# EAGLE design Digi32MCU (EAGLE 5.11)
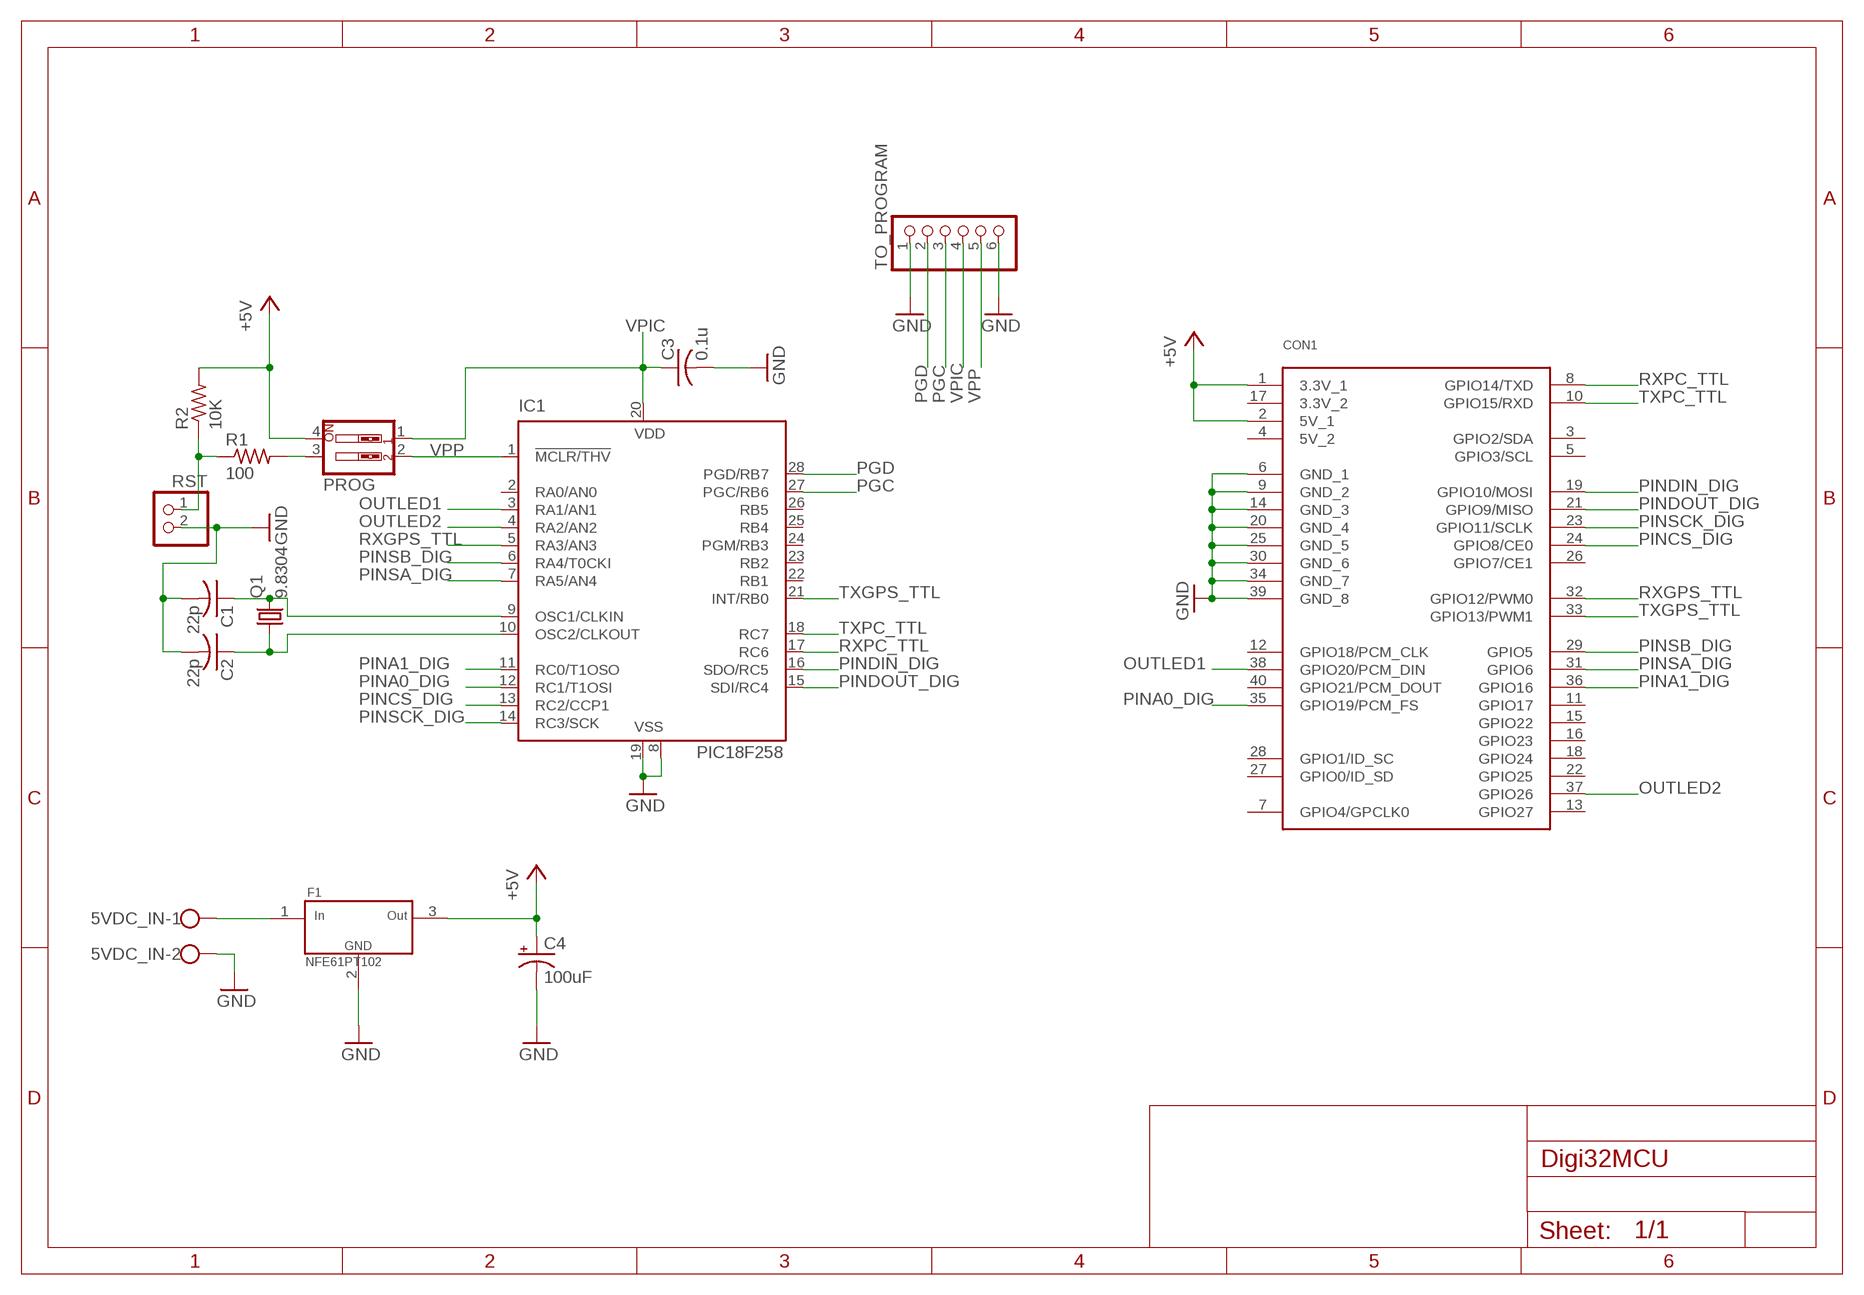
[diagram p0: schematic, sheet 1]

## Parts
5VDC_IN  W237-102  [W237-102]
C1  22p  C-USC0603  [C0603]
C2  22p  C-USC0603  [C0603]
C3  0.1u  C-USC0603  [C0603]
C4  100uF  CPOL-USE  [PANASONIC_E]
CON1  DIGI32_MCU  [MCU_32]
F1  NFE61PT102  EMIFIL  [NFE-2706]
IC1  PIC18F258  PIC16F876SO  [SO28W]
PROG  SW_DIP-2  [EDG-02]
Q1  9.8304  CRYSTALSM49  [SM49]
R1  100  R-US_R0603  [R0603]
R2  10K  R-US_R0603  [R0603]
RST  PINHD-1X2/90  [1X02/90]
TO_PROGRAM  PINHD-1X6/90  [1X06/90]

## Nets
+5V: C4.+ CON1.1(3.3V_1) CON1.2(5V_1) F1.3 PROG.4 R2.2
GND: 5VDC_IN.2 C1.2 C2.2 C3.2 C4.- CON1.6(GND_1) CON1.9(GND_2) CON1.14(GND_3) CON1.20(GND_4) CON1.25(GND_5) CON1.30(GND_6) CON1.34(GND_7) CON1.39(GND_8) F1.2 IC1.8(VSS) IC1.19(VSS) RST.2 TO_PROGRAM.1 TO_PROGRAM.6
N$1: C1.1 IC1.9(OSC1/CLKIN) Q1.2
N$2: C2.1 IC1.10(OSC2/CLKOUT) Q1.1
N$6: 5VDC_IN.1 F1.1
N$7: R1.1 R2.1 RST.1
N$8: PROG.3 R1.2
OUTLED1: CON1.38(GPIO20/PCM_DIN) IC1.3(RA1/AN1)
OUTLED2: CON1.37(GPIO26) IC1.4(RA2/AN2)
PGC: IC1.27(PGC/RB6) TO_PROGRAM.3
PGD: IC1.28(PGD/RB7) TO_PROGRAM.2
PINA0_DIG: CON1.35(GPIO19/PCM_FS) IC1.12(RC1/T1OSI)
PINA1_DIG: CON1.36(GPIO16) IC1.11(RC0/T1OSO)
PINCS_DIG: CON1.24(GPIO8/CE0) IC1.13(RC2/CCP1)
PINDIN_DIG: CON1.19(GPIO10/MOSI) IC1.16(SDO/RC5)
PINDOUT_DIG: CON1.21(GPIO9/MISO) IC1.15(SDI/RC4)
PINSA_DIG: CON1.31(GPIO6) IC1.7(RA5/AN4)
PINSB_DIG: CON1.29(GPIO5) IC1.6(RA4/T0CKI)
PINSCK_DIG: CON1.23(GPIO11/SCLK) IC1.14(RC3/SCK)
RXGPS_TTL: CON1.32(GPIO12/PWM0) IC1.5(RA3/AN3)
RXPC_TTL: CON1.8(GPIO14/TXD) IC1.17(RC6)
TXGPS_TTL: CON1.33(GPIO13/PWM1) IC1.21(INT/RB0)
TXPC_TTL: CON1.10(GPIO15/RXD) IC1.18(RC7)
VPIC: C3.1 IC1.20(VDD) PROG.1 TO_PROGRAM.4
VPP: IC1.1(!MCLR/THV) PROG.2 TO_PROGRAM.5
Unconnected: CON1.3(GPIO2/SDA) CON1.5(GPIO3/SCL) CON1.7(GPIO4/GPCLK0) CON1.11(GPIO17) CON1.12(GPIO18/PCM_CLK) CON1.13(GPIO27) CON1.15(GPIO22) CON1.16(GPIO23) CON1.18(GPIO24) CON1.22(GPIO25) CON1.26(GPIO7/CE1) CON1.27(GPIO0/ID_SD) CON1.28(GPIO1/ID_SC) CON1.40(GPIO21/PCM_DOUT) IC1.2(RA0/AN0) IC1.22(RB1) IC1.23(RB2) IC1.24(PGM/RB3) IC1.25(RB4) IC1.26(RB5)

## Power pins joined to a net without a drawn wire
3.3V_2: CON1.17(3.3V_2)
5V_2: CON1.4(5V_2)

## Library data of the parts
5VDC_IN = con-wago-500:W237-102: WAGO SCREW CLAMP; MPN: 237-102; OC_FARNELL: unknown; OC_NEWARK: 70K9898
C1-C3 = rcl:C-US: CAPACITOR, American symbol
C4 = rcl:CPOL-US: POLARIZED CAPACITOR, American symbol
CON1 = LibraryMagnet:DIGI32_MCU
F1 = magnetometro:EMIFIL
IC1 = microchip:PIC16*876: MICROCONTROLLER flash type; MF: MICROCHIP; MPN: PIC16F876-20/SO; OC_FARNELL: 9761268; OC_NEWARK: 12C1950
PROG = special:SW_DIP-2: DIP SWITCH
Q1 = crystal:CRYSTAL: CRYSTAL; OC_FARNELL: unknown; OC_NEWARK: unknown
R1 R2 = rcl:R-US_: RESISTOR, American symbol
RST = pinhead:PINHD-1X2: PIN HEADER
TO_PROGRAM = pinhead:PINHD-1X6: PIN HEADER

## Board
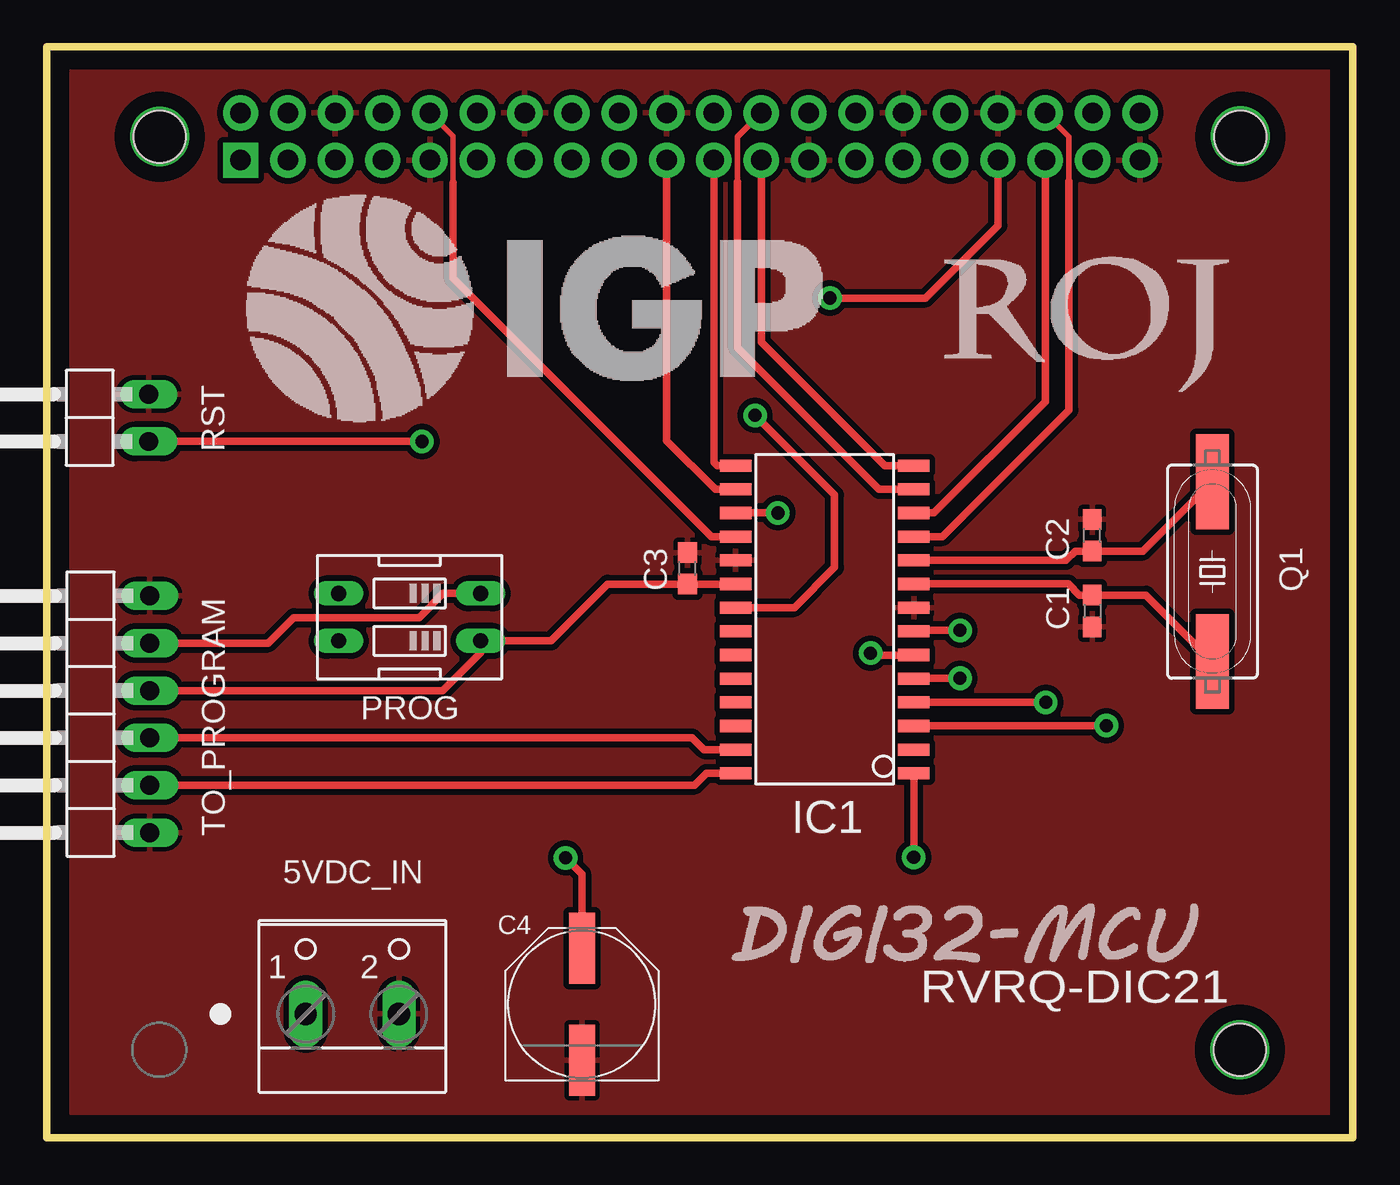
[diagram p1: board, top side]
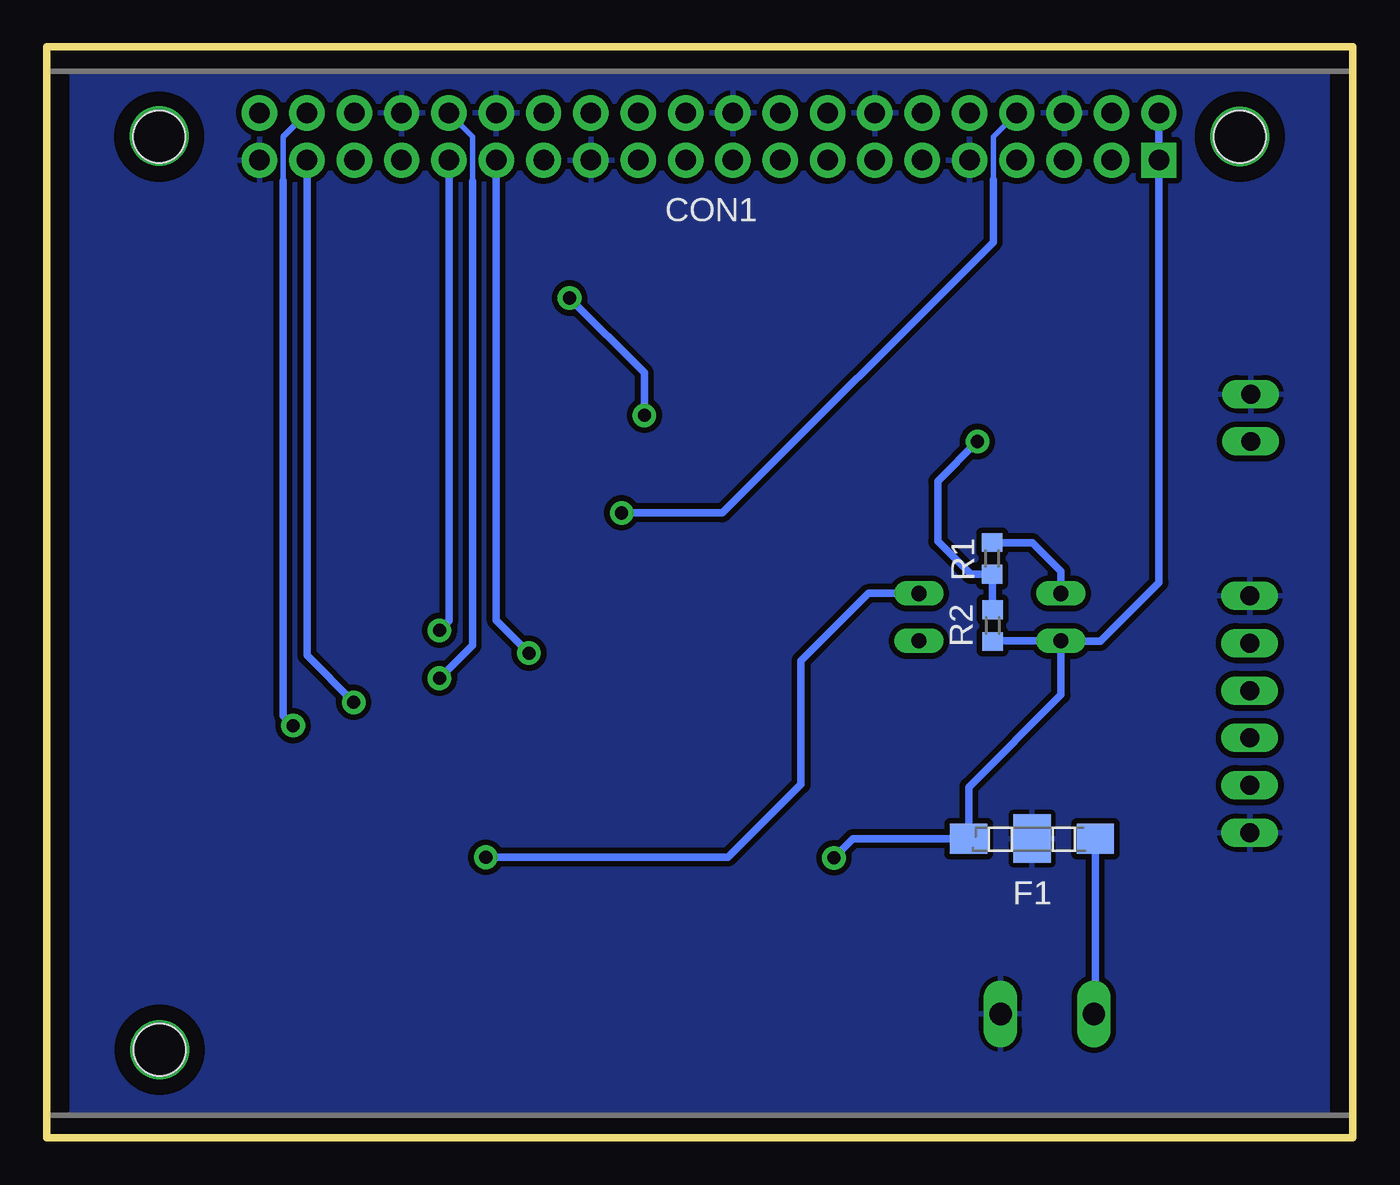
[diagram p2: board, bottom side, seen from below]

Size 70.1 x 58.55 mm. Coordinates in mm from the lower left corner, seen from the top.
Outline: 0,0 70.1,0 70.1,58.55 0,58.55 0,0
Copper layers (1*16): Top 0.035mm / dielectric 1.5mm / Bottom 0.035mm
Design rules "default": minimum track width 10mil, minimum drill 24mil, track to track 8mil, track to pad 8mil, pad to pad 8mil, via to via 8mil, smd to smd 8mil, copper to edge 40mil, drill to drill 8mil, minimum pad ring 10mil, minimum via ring 8mil, stop-mask expansion 4mil, vias tented up to drill 0mil, thermal gap 10mil

### Footprints (pad centres in the part's own frame; a part is rotated, then mirrored left to right if it is on the bottom)
W237-102 = drill 1.194 long: 1 -2.5,-0.381; 2 2.5,-0.381
C0603 = smd 1.1 x 1: 1 -0.85,0; 2 0.85,0
PANASONIC_E = smd 3.8 x 1.4: + 3,0; - -3,0
MCU_32 = drill 1.1 pad 1.9 square: 1 24.13,-1.27 | drill 1.1 pad 1.9 round: 2 24.13,1.27; 3 21.59,-1.27; 4 21.59,1.27; 5 19.05,-1.27; 6 19.05,1.27; 7 16.51,-1.27; 8 16.51,1.27; 9 13.97,-1.27; 10 13.97,1.27; 11 11.43,-1.27; 12 11.43,1.27; 13 8.89,-1.27; 14 8.89,1.27; 15 6.35,-1.27; 16 6.35,1.27; 17 3.81,-1.27; 18 3.81,1.27; 19 1.27,-1.27; 20 1.27,1.27; 21 -1.27,-1.27; 22 -1.27,1.27; 23 -3.81,-1.27; 24 -3.81,1.27; 25 -6.35,-1.27; 26 -6.35,1.27; 27 -8.89,-1.27; 28 -8.89,1.27; 29 -11.43,-1.27; 30 -11.43,1.27; 31 -13.97,-1.27; 32 -13.97,1.27; 33 -16.51,-1.27; 34 -16.51,1.27; 35 -19.05,-1.27; 36 -19.05,1.27; 37 -21.59,-1.27; 38 -21.59,1.27; 39 -24.13,-1.27; 40 -24.13,1.27 | hole 2.8: -29.516,0; -29.5,-49; 28.484,0
NFE-2706 = smd 2 x 1.6: 1 -3.4,0; 3 3.4,0 | smd 2 x 2.6: 2 0,0
SO28W = smd 0.65 x 1.7: 1 -8.255,-4.78; 2 -6.985,-4.78; 3 -5.715,-4.78; 4 -4.445,-4.78; 5 -3.175,-4.78; 6 -1.905,-4.78; 7 -0.635,-4.78; 8 0.635,-4.78; 9 1.905,-4.78; 10 3.175,-4.78; 11 4.445,-4.78; 12 5.715,-4.78; 13 6.985,-4.78; 14 8.255,-4.78; 15 8.255,4.78; 16 6.985,4.78; 17 5.715,4.78; 18 4.445,4.78; 19 3.175,4.78; 20 1.905,4.78; 21 0.635,4.78; 22 -0.635,4.78; 23 -1.905,4.78; 24 -3.175,4.78; 25 -4.445,4.78; 26 -5.715,4.78; 27 -6.985,4.78; 28 -8.255,4.78
EDG-02 = drill 0.813 long: 1 -1.27,-3.81; 2 1.27,-3.81; 3 1.27,3.81; 4 -1.27,3.81
SM49 = smd 5.08 x 1.778: 1 -4.826,0; 2 4.826,0
R0603 = smd 1 x 1.1: 1 -0.85,0; 2 0.85,0
1X02/90 = drill 1.016 long: 1 -1.27,-3.81; 2 1.27,-3.81
1X06/90 = drill 1.016 long: 1 -6.35,-3.81; 2 -3.81,-3.81; 3 -1.27,-3.81; 4 1.27,-3.81; 5 3.81,-3.81; 6 6.35,-3.81

### Placement (x,y rotation side)
5VDC_IN  16.41,7.04 0 top
C1  56.11,28.27 270 top
C2  56.11,32.33 90 top
C3  34.39,30.56 90 top
C4  28.73,7.18 90 top
CON1  34.54,53.72 0 bottom
F1  17.22,16.05 180 bottom
IC1  41.76,27.81 90 top
PROG  19.48,27.94 90 top
Q1  62.56,30.38 270 top
R1  19.35,31.09 90 bottom
R2  19.33,27.48 270 bottom
RST  1.68,38.63 90 top
TO_PROGRAM  1.73,22.73 90 top

### Tracks (layer width: path | path; a pad name or v marks a point on that pad's centre or on a via)
+5V  (via drill 0.7 pad 1.27)
  Top 0.406: v27.85,15.02 28.73,14.15 C4.+
  Bottom 0.406: R2.2 19.29,26.67 PROG.4 | CON1.2 CON1.1 10.41,29.79 13.56,26.64 15.65,26.64 PROG.4 | PROG.4 15.67,23.77 20.62,18.82 F1.3 26.82,16.05 v27.85,15.02
GND
  pour Top (isolate 0.305): -0.79,58.14 72.29,58.14 72.29,-0.15 -0.79,-0.15
  pour Bottom (isolate 0.305): -2.57,60.5 73.48,60.5 73.48,-2.18 -2.57,-2.18
N$1
  Top 0.406: IC1.9 54.84,29.72 55.44,29.12 C1.1 58.99,29.12 Q1.2
N$2
  Top 0.406: IC1.10 54.71,30.99 55.21,31.48 C2.1 58.84,31.48 Q1.1
N$3  (via drill 2.16)
  other vias: 6.07,53.72
N$4  (via drill 2.16)
  other vias: 64.06,53.75
N$5  (via drill 2.16)
  other vias: 64.03,4.72
N$6
  Bottom 0.406: F1.1 13.82,6.74 5VDC_IN.1
N$7  (via drill 0.7 pad 1.27)
  Top 0.406: RST.1 v20.14,37.36
  Bottom 0.406: R2.1 19.35,28.36 R1.1 20.51,30.24 22.28,32 22.28,35.23 v20.14,37.36
N$8
  Bottom 0.406: R1.2 17.21,31.94 15.67,30.4 PROG.3
OUTLED1  (via drill 0.7 pad 1.27)
  Top 0.406: v56.87,22.12 46.56,22.12 IC1.3
  Bottom 0.305: CON1.38 57.4,53.72 57.4,51.36
  Bottom 0.406: 57.4,51.36 57.4,22.66 v56.87,22.12
OUTLED2  (via drill 0.7 pad 1.27)
  Top 0.406: IC1.4 v53.62,23.37
  Bottom 0.406: CON1.37 56.13,25.88 v53.62,23.37
PGC
  Top 0.406: TO_PROGRAM.3 34.65,21.46 35.28,20.83 IC1.27
PGD
  Top 0.406: TO_PROGRAM.2 34.77,18.92 35.41,19.56 IC1.28
PINA0_DIG
  Top 0.406: CON1.35 53.59,39.5 47.63,33.53 IC1.12
PINA1_DIG
  Top 0.305: CON1.36 54.86,53.72 54.86,51.33
  Top 0.406: 54.86,51.33 54.86,39.04 48.08,32.26 IC1.11
PINCS_DIG
  Top 0.305: CON1.24 37.08,53.72 37.08,51.31
  Top 0.406: 37.08,51.31 37.08,42.39 44.68,34.8 IC1.13
PINDIN_DIG
  Top 0.406: CON1.19 33.27,37.41 35.89,34.8 IC1.16
PINDOUT_DIG
  Top 0.406: CON1.21 35.81,36.25 35.99,36.07 IC1.15
PINSA_DIG  (via drill 0.7 pad 1.27)
  Top 0.406: v49.02,27.23 46.59,27.23 IC1.7
  Bottom 0.406: CON1.31 48.51,27.74 v49.02,27.23
PINSB_DIG  (via drill 0.7 pad 1.27)
  Top 0.406: v44.22,26.01 44.32,25.91 IC1.6
  Bottom 0.406: CON1.29 45.97,27.76 v44.22,26.01
PINSCK_DIG
  Top 0.406: CON1.23 38.35,42.7 44.98,36.07 IC1.14
RXGPS_TTL  (via drill 0.7 pad 1.27)
  Top 0.406: v49.02,24.66 46.56,24.66 IC1.5
  Bottom 0.305: CON1.32 47.24,53.72 47.24,51.33
  Bottom 0.406: 47.24,51.33 47.24,26.44 v49.02,24.66
RXPC_TTL  (via drill 0.7 pad 1.27)
  Top 0.406: v39.24,33.53 IC1.17
  Bottom 0.305: CON1.8 19.3,53.72 19.3,51.41
  Bottom 0.406: 19.3,51.41 19.3,48.06 33.83,33.53 v39.24,33.53
TXGPS_TTL  (via drill 0.7 pad 1.27)
  Top 0.406: IC1.21 40.13,28.45 42.29,30.61 42.29,34.49 v38.02,38.76 | v42.04,45.06 47.17,45.06 51.05,48.95 CON1.33
  Bottom 0.406: v38.02,38.76 38.02,41.05 v42.04,45.06
TXPC_TTL
  Top 0.305: CON1.10 21.82,53.75 21.82,51.23
  Top 0.406: 21.82,51.23 21.82,46.13 35.69,32.26 IC1.18
VPIC
  Top 0.406: TO_PROGRAM.4 21.26,24 23.29,26.03 PROG.1 27.08,26.67 30.11,29.71 C3.1 36.97,29.71 IC1.20
VPP  (via drill 0.7 pad 1.27)
  Top 0.406: TO_PROGRAM.5 11.89,26.54 13.26,27.91 19.99,27.91 21.29,29.21 PROG.2 | v46.53,15.06 IC1.1
  Bottom 0.406: PROG.2 26.01,29.21 29.62,25.6 29.62,18.97 33.53,15.06 v46.53,15.06

### Text on the board
tPlace: RVRQ-DIC21